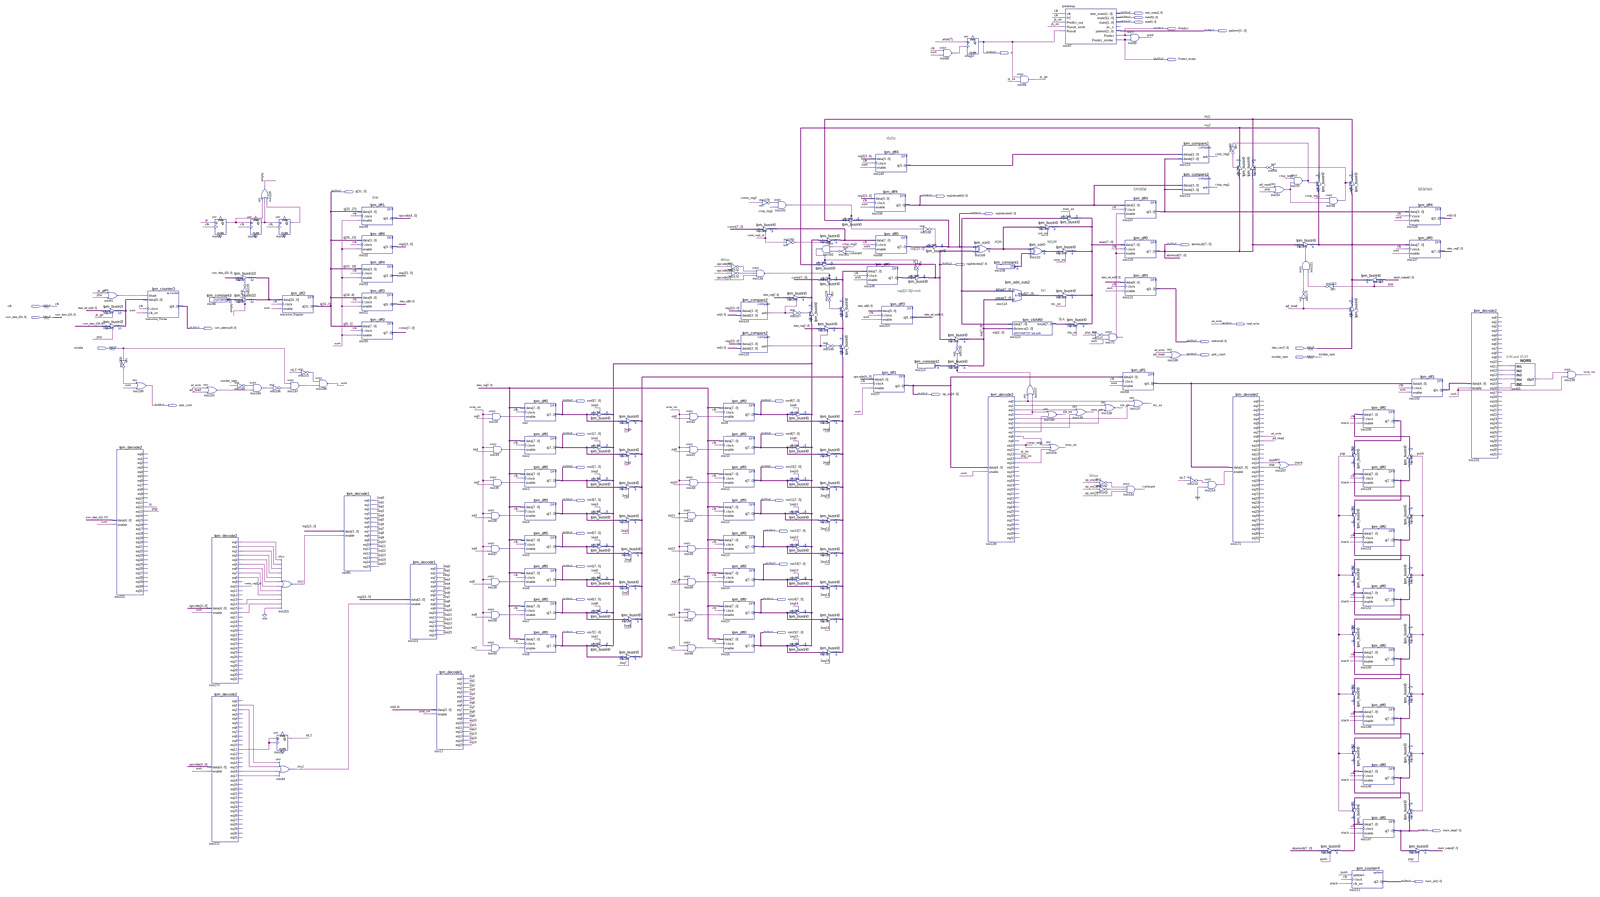
[diagram p0: schematic sheet, whole]
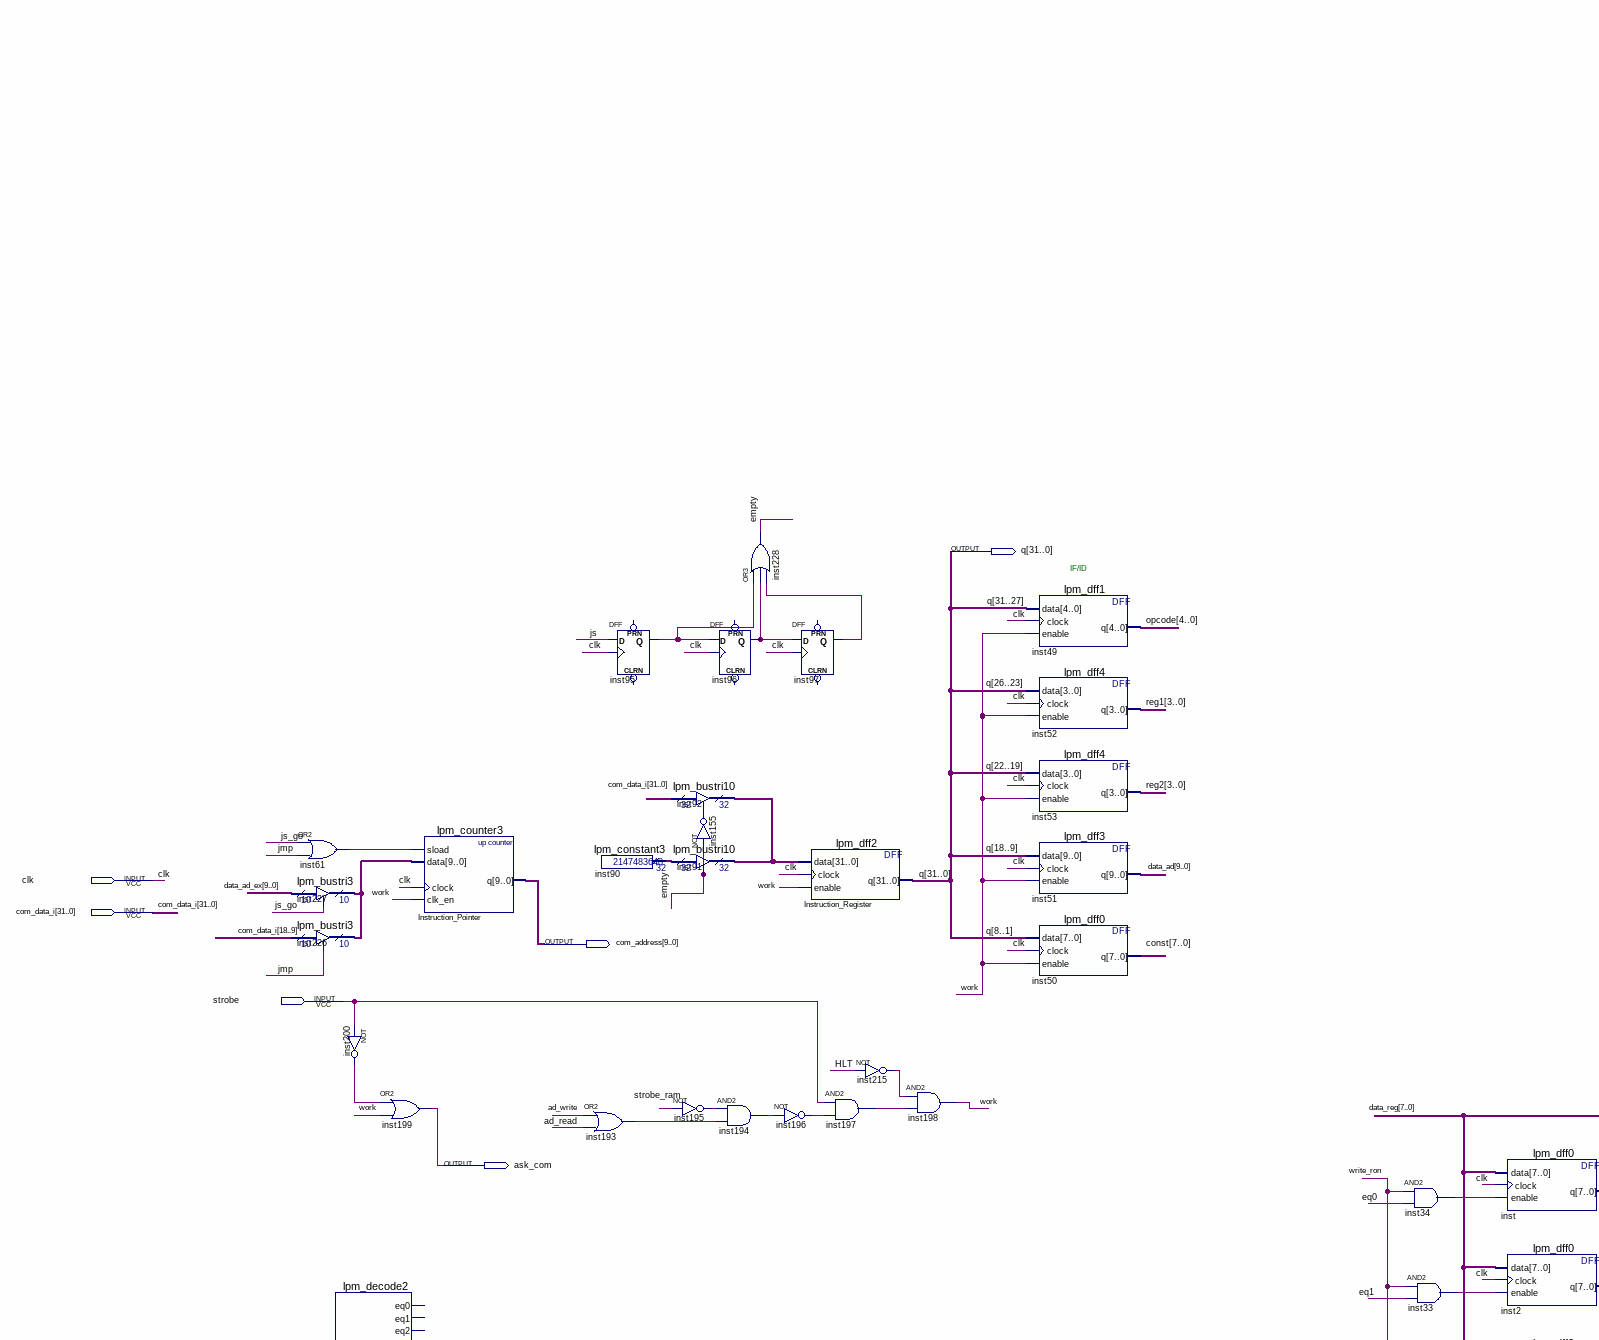
[diagram p1: schematic sheet, upper left part]
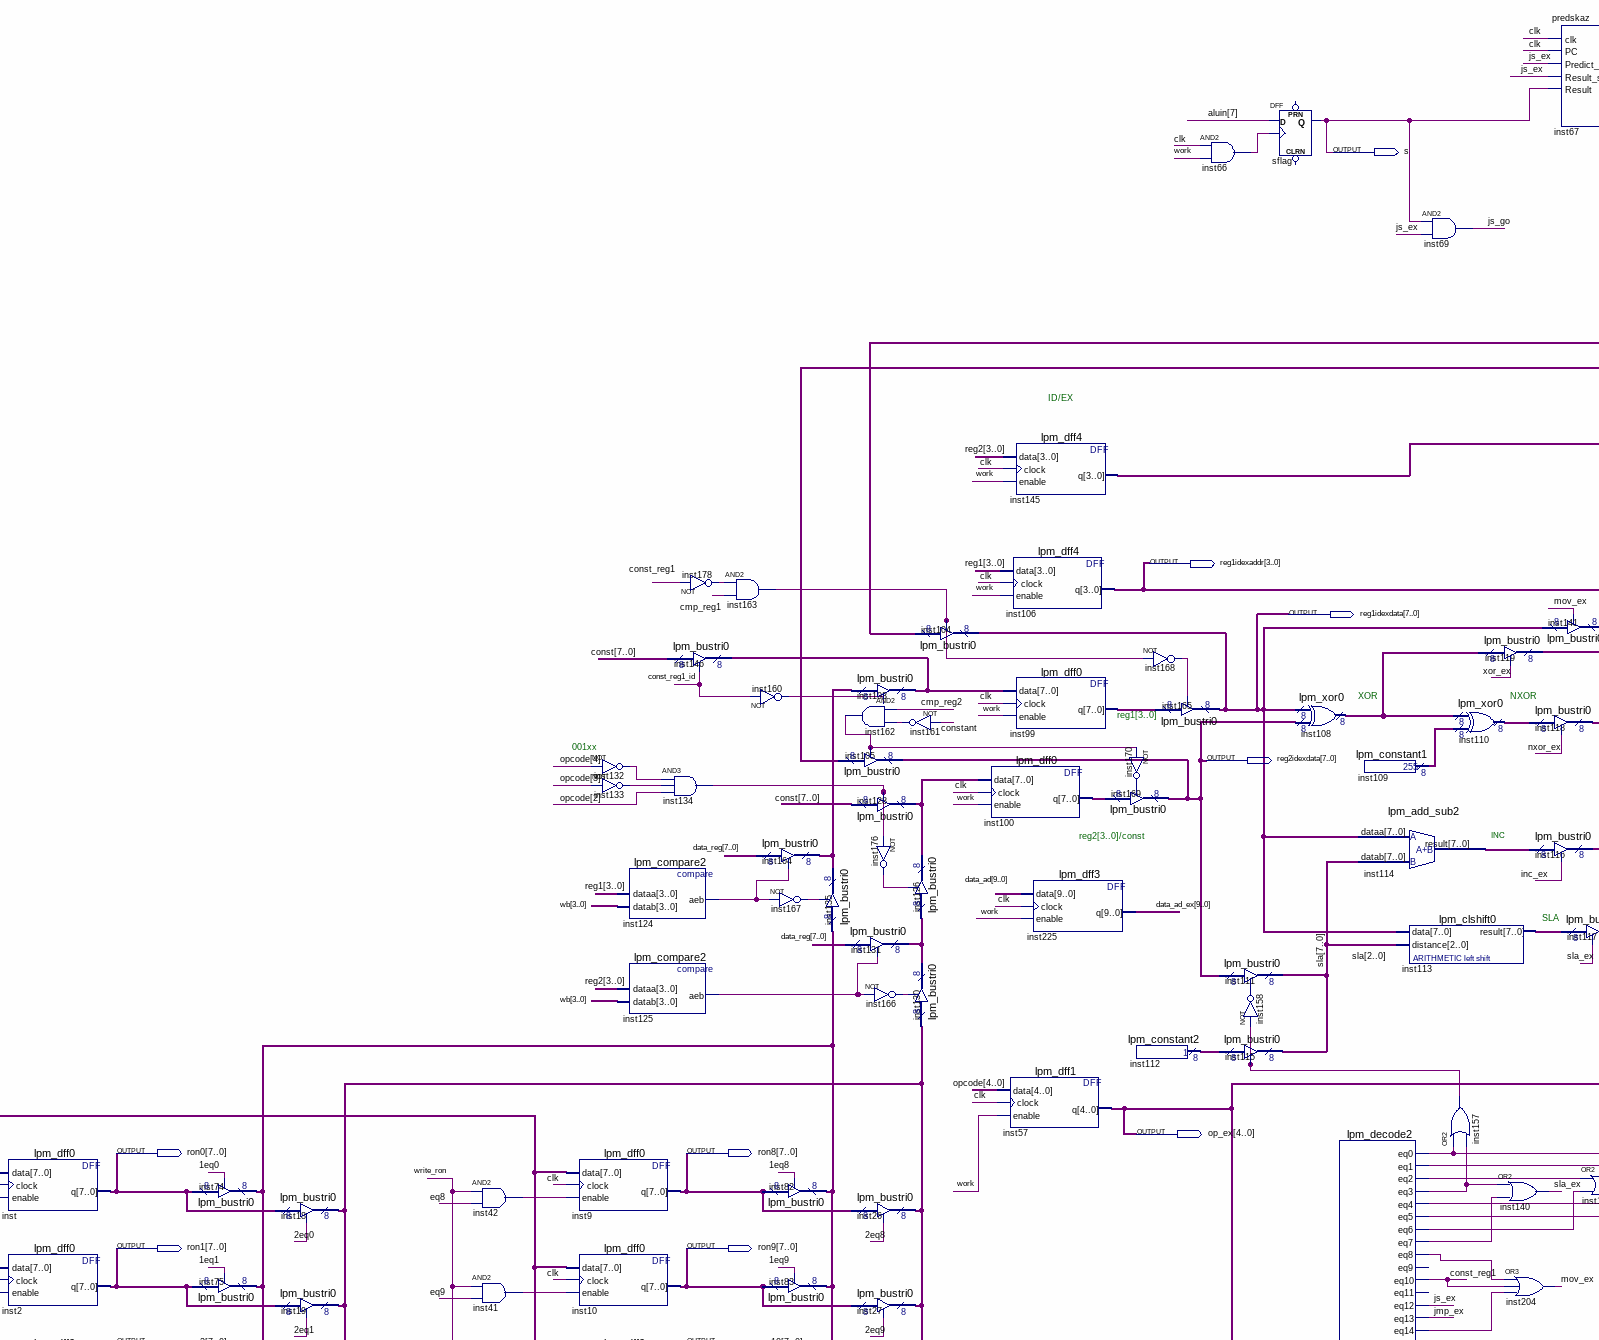
[diagram p2: schematic sheet, upper centre part]
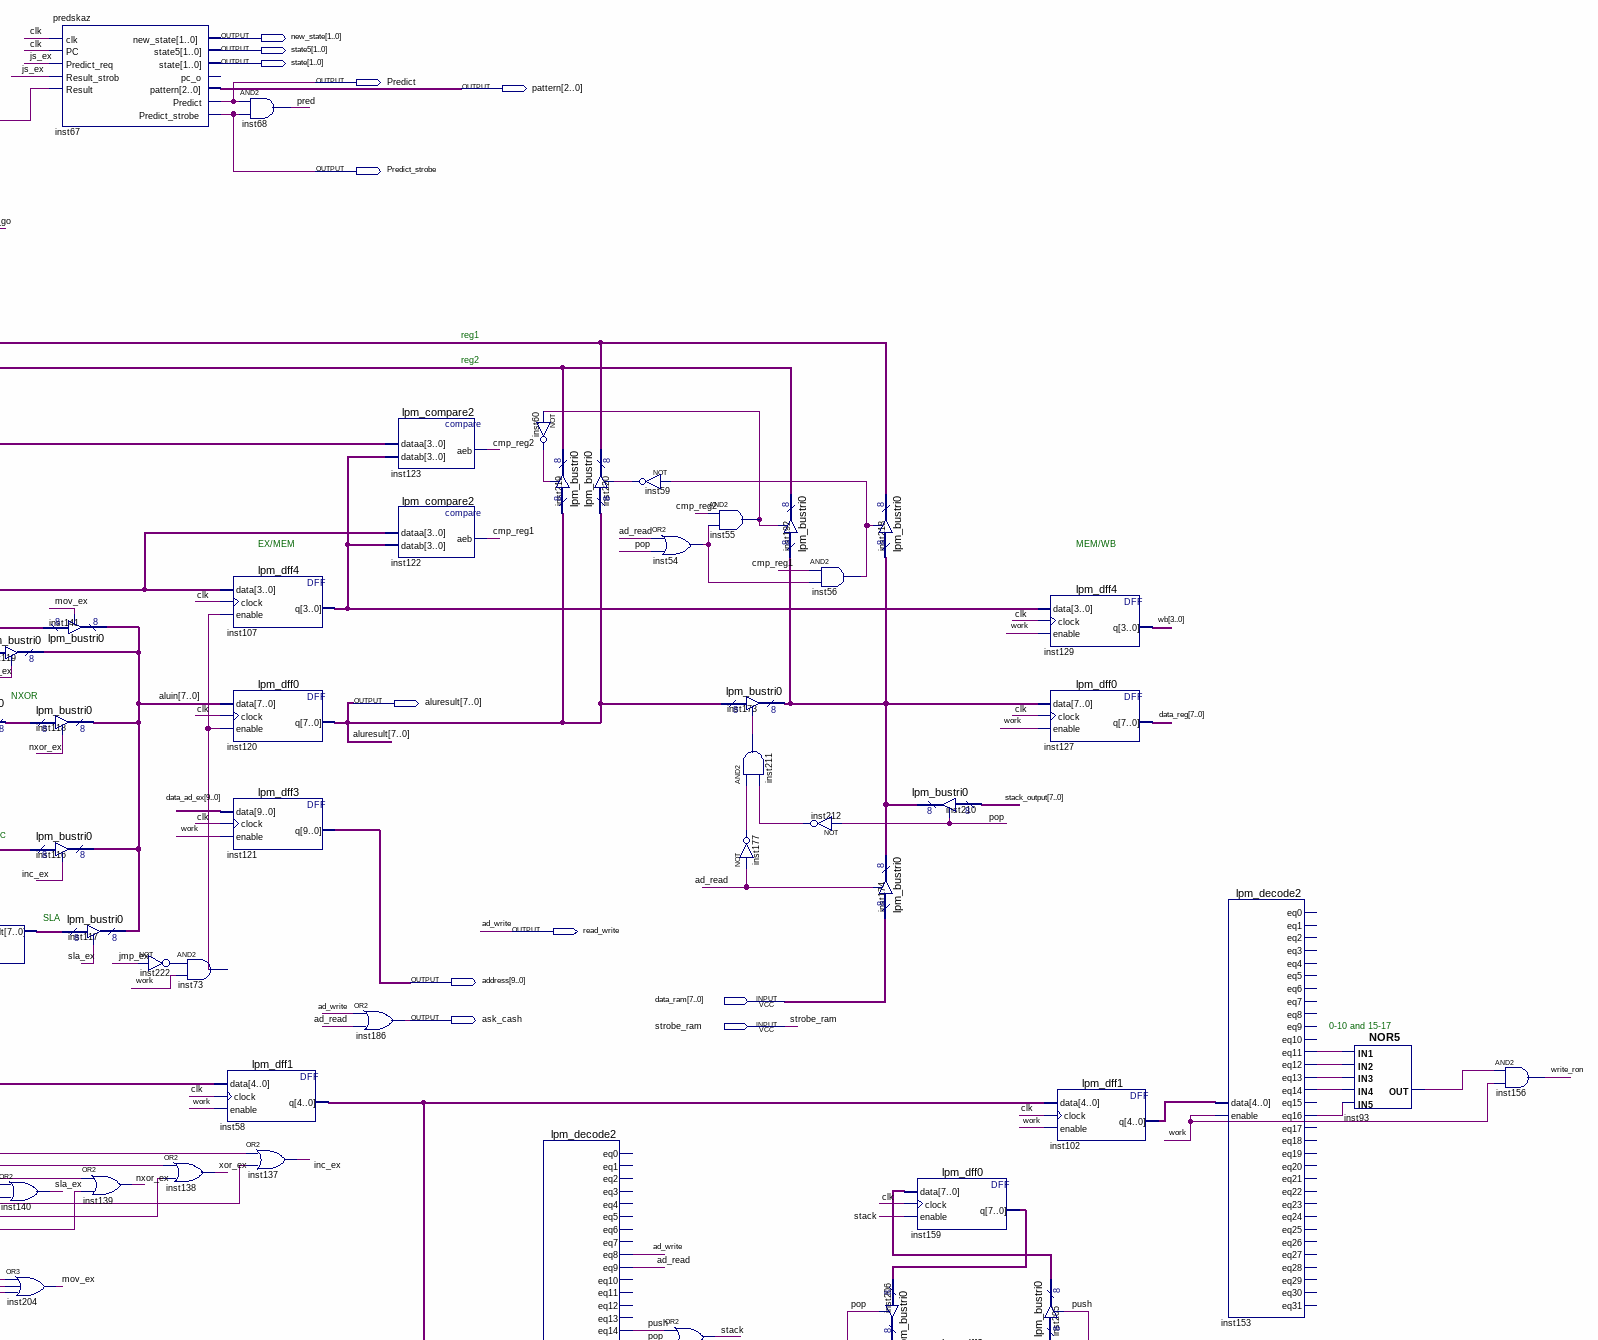
[diagram p3: schematic sheet, upper right part]
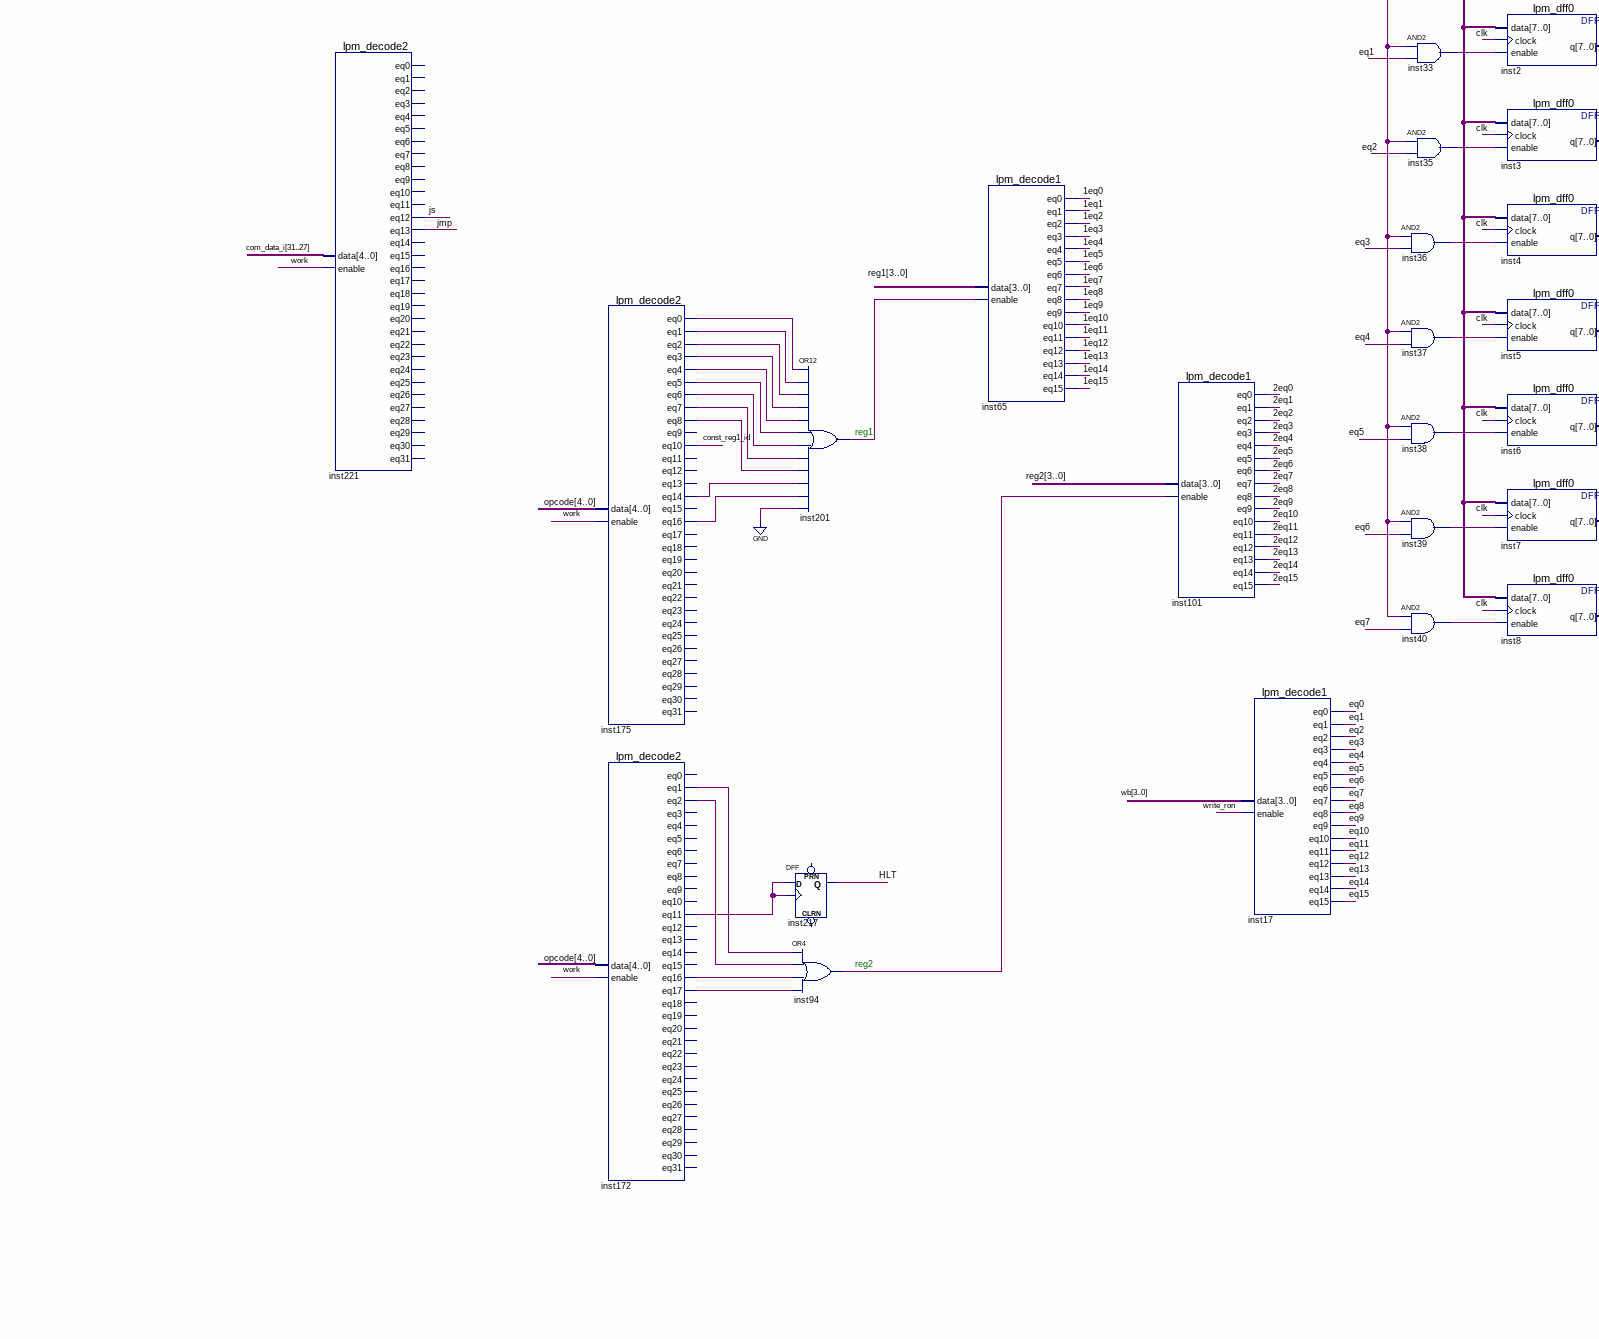
[diagram p4: schematic sheet, lower left part]
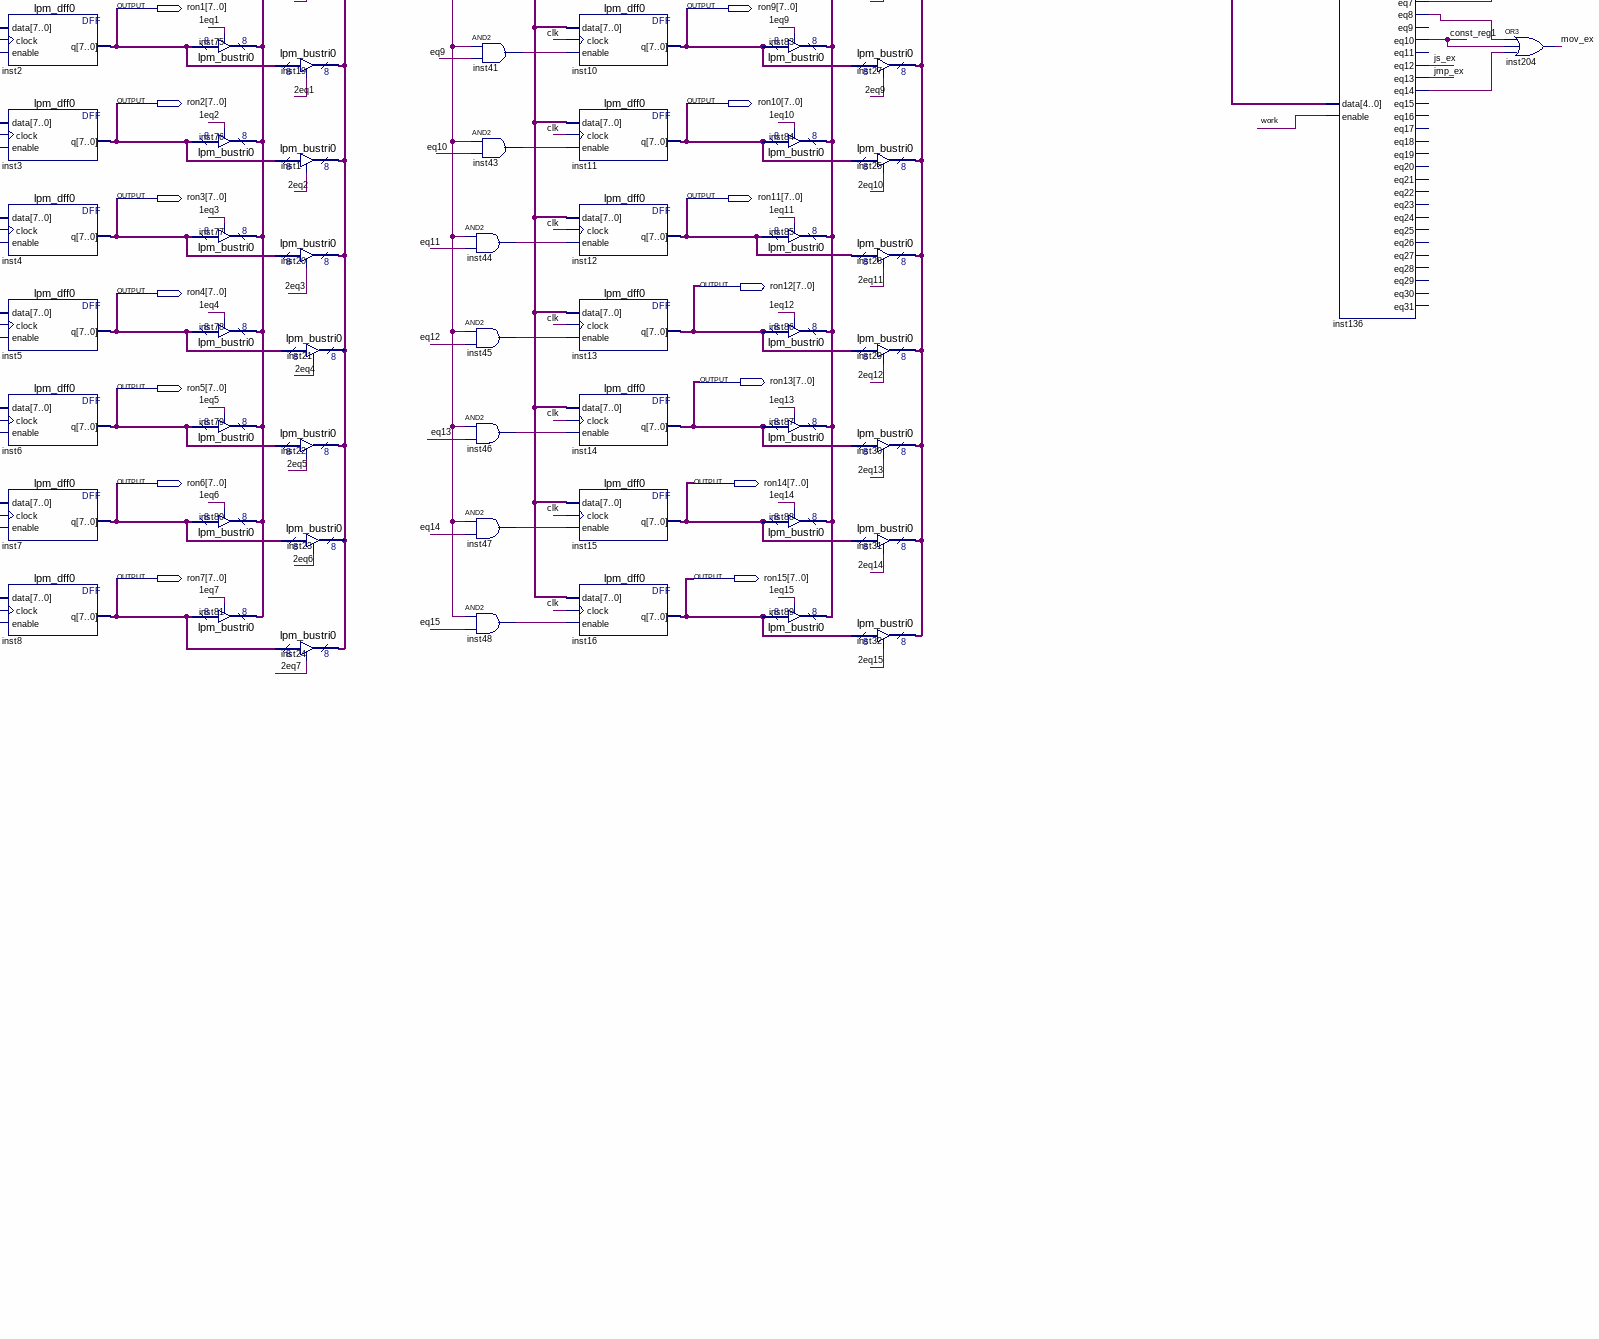
[diagram p5: schematic sheet, lower centre part]
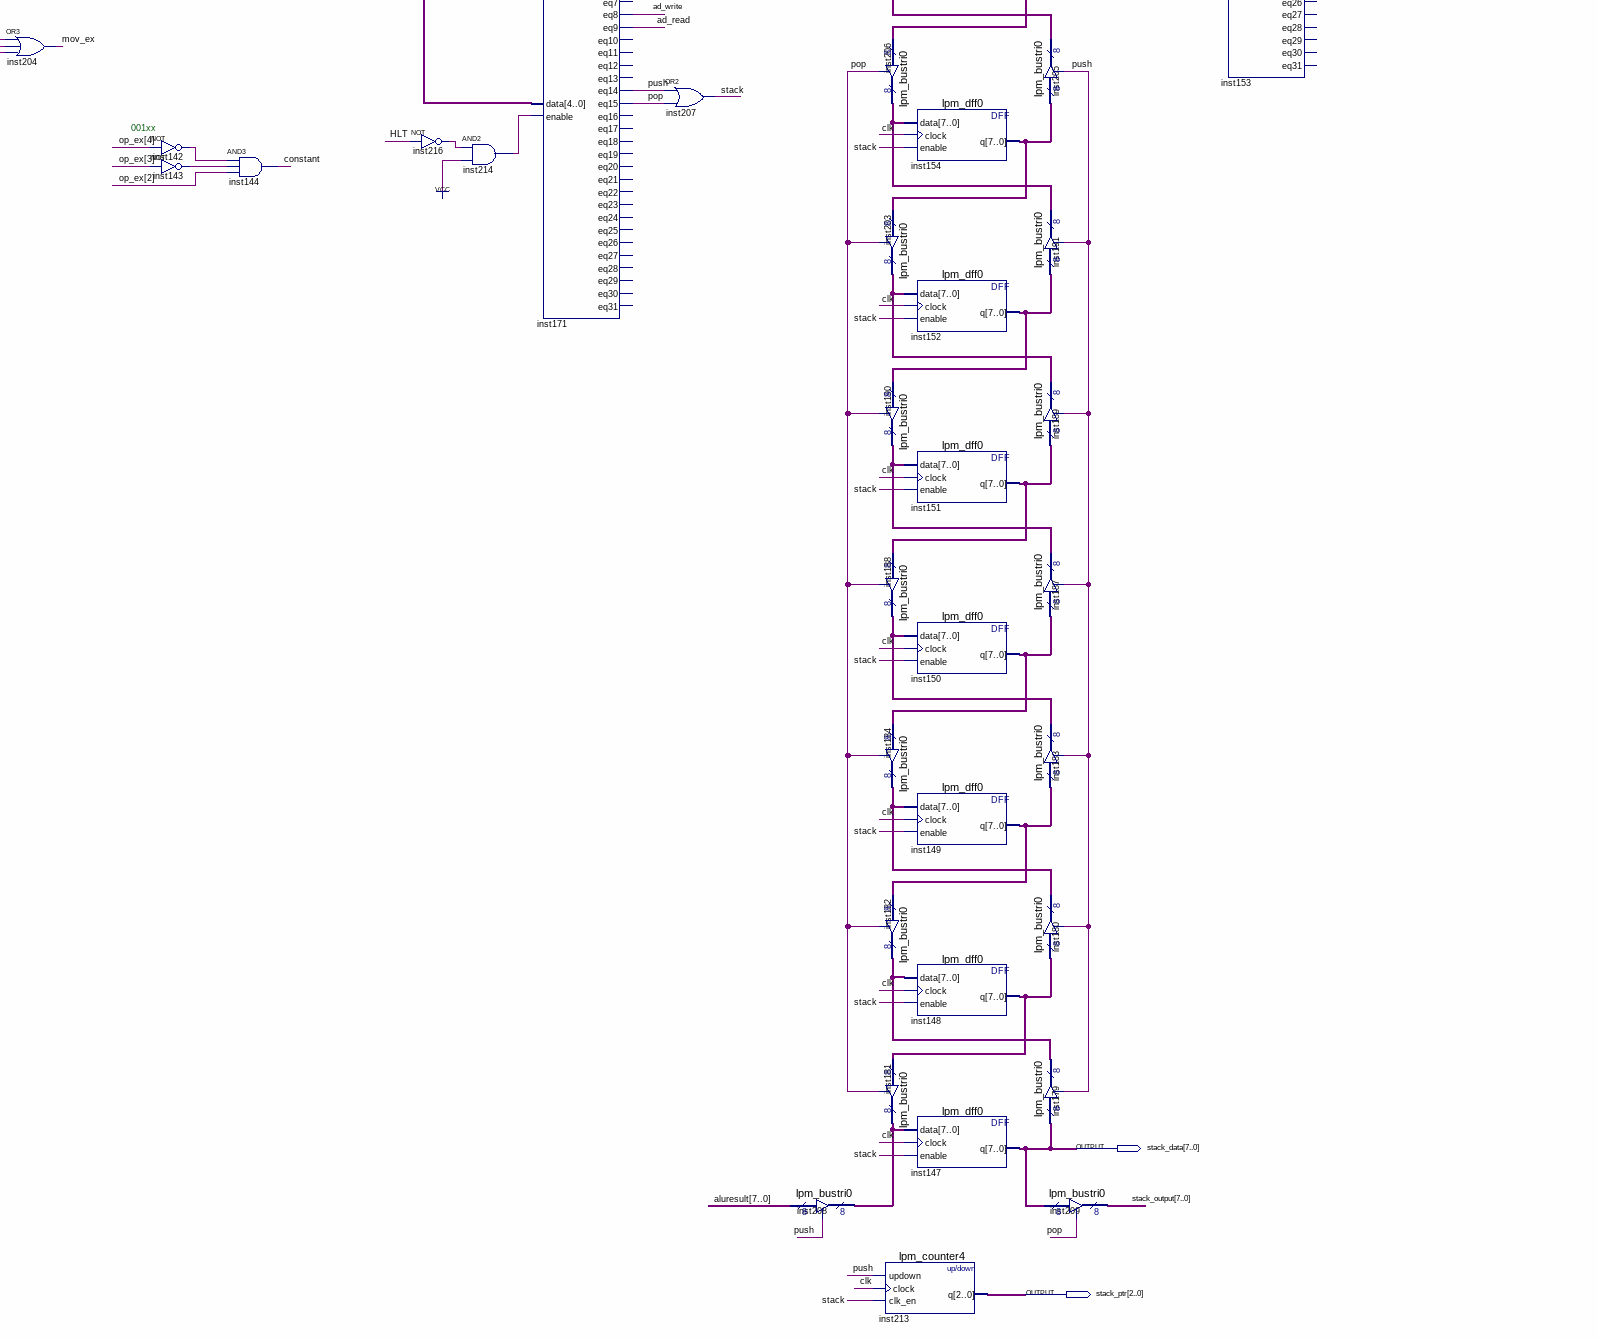
[diagram p6: schematic sheet, lower right part]
// Quartus schematic konveer.bdf as structural Verilog: 221 symbols, 41 pins
module konveer (
  input  clk,
  input  [31:0] com_data_i,
  input  strobe,
  input  [7:0] data_ram,
  input  strobe_ram,
  output [1:0] new_state,
  output [1:0] state5,
  output [1:0] state,
  output Predict,
  output [2:0] pattern,
  output s,
  output Predict_strobe,
  output [31:0] q,
  output [3:0] reg1idexaddr,
  output [7:0] reg1idexdata,
  output [7:0] aluresult,
  output [7:0] reg2idexdata,
  output read_write,
  output [9:0] com_address,
  output [9:0] address,
  output ask_cash,
  output [4:0] op_ex,
  output [7:0] ron0,
  output [7:0] ron8,
  output ask_com,
  output [7:0] ron1,
  output [7:0] ron9,
  output [7:0] ron2,
  output [7:0] ron10,
  output [7:0] ron3,
  output [7:0] ron11,
  output [7:0] ron12,
  output [7:0] ron4,
  output [7:0] ron13,
  output [7:0] ron5,
  output [7:0] ron6,
  output [7:0] ron14,
  output [7:0] ron7,
  output [7:0] ron15,
  output [7:0] stack_data,
  output [2:0] stack_ptr
);

  wire \1eq0 , \1eq1 , \1eq2 , \1eq3 , \1eq4 , \1eq5 , \1eq6 , \1eq7 , \1eq8 , \1eq9 , \1eq10 , \1eq11 ,
       \1eq12 , \1eq13 , \1eq14 , \1eq15 , \2eq0 , \2eq1 , \2eq2 , \2eq3 , \2eq4 , \2eq5 , \2eq6 , \2eq7 ,
       \2eq8 , \2eq9 , \2eq10 , \2eq11 , \2eq12 , \2eq13 , \2eq14 , \2eq15 , ad_read, cmp_reg1, cmp_reg2,
       const_reg1, const_reg1_id, constant, empty, eq0, eq1, eq2, eq3, eq4, eq5, eq6, eq7, eq8, eq9, eq10,
       eq11, eq12, eq13, eq14, eq15, HLT, inc_ex, inst33_out, inst34_out, inst35_out, inst36_out, inst37_out,
       inst38_out, inst39_out, inst40_out, inst41_out, inst42_out, inst43_out, inst44_out, inst45_out,
       inst46_out, inst47_out, inst48_out, inst54_out, inst55_out, inst56_out, inst59_out, inst60_out,
       inst61_out, inst66_out, inst73_out, inst93_out, inst94_out, inst95_q, inst96_q, inst97_q, inst124_aeb,
       inst125_aeb, inst132_out, inst133_out, inst134_out, inst136_eq0, inst136_eq1, inst136_eq2,
       inst136_eq3, inst136_eq4, inst136_eq5, inst136_eq6, inst136_eq7, inst136_eq8, inst136_eq14,
       inst142_out, inst143_out, inst153_eq11, inst153_eq12, inst153_eq13, inst153_eq14, inst153_eq16,
       inst155_out, inst157_out, inst158_out, inst160_out, inst161_out, inst162_out, inst163_out,
       inst166_out, inst167_out, inst168_out, inst170_out, inst172_eq1, inst172_eq2, inst172_eq11,
       inst172_eq16, inst172_eq17, inst175_eq0, inst175_eq1, inst175_eq2, inst175_eq3, inst175_eq4,
       inst175_eq5, inst175_eq6, inst175_eq7, inst175_eq8, inst175_eq14, inst175_eq16, inst176_out,
       inst177_out, inst178_out, inst193_out, inst194_out, inst195_out, inst196_out, inst197_out,
       inst200_out, inst201_out, inst211_out, inst212_out, inst214_out, inst215_out, inst216_out,
       inst222_out, jmp, jmp_ex, js, js_ex, js_go, mov_ex, nxor_ex, pop, pred, push, sla_ex, stack, work,
       write_ron, xor_ex;
  wire [3:0] inst107_q, inst145_q, reg1, reg2, wb;
  wire [4:0] inst58_q, inst102_q, opcode;
  wire [7:0] aluin, \const , data_reg, inst18_tridata, inst74_tridata, inst99_q, inst100_q, inst108_result,
       inst109_result, inst110_result, inst112_result, inst113_result, inst114_result, inst128_tridata,
       inst131_tridata, inst146_tridata, inst148_q, inst149_q, inst150_q, inst151_q, inst152_q, inst154_q,
       inst159_q, inst164_tridata, inst173_tridata, inst182_tridata, inst184_tridata, inst188_tridata,
       inst190_tridata, inst203_tridata, inst205_tridata, inst206_tridata, inst208_tridata, inst219_tridata,
       inst220_tridata, sla, stack_output;
  wire [9:0] data_ad, data_ad_ex, inst227_tridata;
  wire [31:0] inst90_result, inst92_tridata;

  or inst61 (inst61_out, js_go, jmp);
  lpm_bustri3 inst227 (.enabledt(js_go), .data(data_ad_ex), .tridata(inst227_tridata));
  lpm_bustri3 inst226 (.enabledt(jmp), .data(com_data_i[18:9]), .tridata(inst227_tridata));
  lpm_decode2 inst221 (
    .data(com_data_i[31:27]), .enable(work), .eq12(js), .eq13(jmp));  // open: eq0, eq1, eq2, eq3, eq4, eq5, eq6, eq7, eq8, eq9, eq10, eq11, eq14, eq15, eq16, eq17, eq18, eq19, eq20, eq21, eq22, eq23, eq24, eq25, eq26, eq27, eq28, eq29, eq30, eq31
  not inst200 (inst200_out, strobe);
  lpm_counter3 Instruction_Pointer (
    .sload(inst61_out), .data(inst227_tridata), .clock(clk), .clk_en(work), .q(com_address));
  or inst199 (ask_com, inst200_out, work);
  DFF inst95 (.CLK(clk), .D(js), .Q(inst95_q));  // open: CLRN, PRN
  lpm_constant3 inst90 (.result(inst90_result));
  or inst193 (inst193_out, read_write, ad_read);
  lpm_decode2 inst175 (
    .data(opcode), .enable(work), .eq0(inst175_eq0), .eq1(inst175_eq1), .eq2(inst175_eq2), .eq3(inst175_eq3),
    .eq4(inst175_eq4), .eq5(inst175_eq5), .eq6(inst175_eq6), .eq7(inst175_eq7), .eq8(inst175_eq8),
    .eq10(const_reg1_id), .eq14(inst175_eq14), .eq16(inst175_eq16));  // open: eq9, eq11, eq12, eq13, eq15, eq17, eq18, eq19, eq20, eq21, eq22, eq23, eq24, eq25, eq26, eq27, eq28, eq29, eq30, eq31
  lpm_decode2 inst172 (
    .data(opcode), .enable(work), .eq1(inst172_eq1), .eq2(inst172_eq2), .eq11(inst172_eq11),
    .eq16(inst172_eq16), .eq17(inst172_eq17));  // open: eq0, eq3, eq4, eq5, eq6, eq7, eq8, eq9, eq10, eq12, eq13, eq14, eq15, eq18, eq19, eq20, eq21, eq22, eq23, eq24, eq25, eq26, eq27, eq28, eq29, eq30, eq31
  lpm_bustri10 inst92 (.enabledt(inst155_out), .data(com_data_i), .tridata(inst92_tridata));
  lpm_bustri10 inst91 (.enabledt(empty), .data(inst90_result), .tridata(inst92_tridata));
  not inst195 (inst195_out, strobe_ram);
  DFF inst96 (.CLK(clk), .D(inst95_q), .Q(inst96_q));  // open: CLRN, PRN
  not inst155 (inst155_out, empty);
  and inst194 (inst194_out, inst195_out, inst193_out);
  or inst228 (empty, inst95_q, inst96_q, inst97_q);
  not inst196 (inst196_out, inst194_out);
  DFF inst97 (.CLK(clk), .D(inst96_q), .Q(inst97_q));  // open: CLRN, PRN
  lpm_dff2 Instruction_Register (.data(inst92_tridata), .clock(clk), .enable(work), .q(q));
  and inst197 (inst197_out, strobe, inst196_out);
  or inst201 (inst201_out, inst175_eq0, inst175_eq1, inst175_eq2, inst175_eq3, inst175_eq4, inst175_eq5, inst175_eq6, inst175_eq7, inst175_eq8, inst175_eq14, inst175_eq16, 1'b0);
  DFF inst217 (.CLK(inst172_eq11), .D(inst172_eq11), .Q(HLT));  // open: CLRN, PRN
  or inst94 (inst94_out, inst172_eq1, inst172_eq2, inst172_eq16, inst172_eq17);
  not inst215 (inst215_out, HLT);
  and inst198 (work, inst215_out, inst197_out);
  lpm_decode1 inst65 (
    .data(reg1), .enable(inst201_out), .eq0(\1eq0 ), .eq1(\1eq1 ), .eq2(\1eq2 ), .eq3(\1eq3 ), .eq4(\1eq4 ),
    .eq5(\1eq5 ), .eq6(\1eq6 ), .eq7(\1eq7 ), .eq8(\1eq8 ), .eq9(\1eq9 ), .eq10(\1eq10 ), .eq11(\1eq11 ),
    .eq12(\1eq12 ), .eq13(\1eq13 ), .eq14(\1eq14 ), .eq15(\1eq15 ));
  lpm_dff1 inst49 (.data(q[31:27]), .clock(clk), .enable(work), .q(opcode));
  lpm_dff4 inst52 (.data(q[26:23]), .clock(clk), .enable(work), .q(reg1));
  lpm_dff4 inst53 (.data(q[22:19]), .clock(clk), .enable(work), .q(reg2));
  lpm_dff3 inst51 (.data(q[18:9]), .clock(clk), .enable(work), .q(data_ad));
  lpm_dff0 inst50 (.data(q[8:1]), .clock(clk), .enable(work), .q(\const ));
  lpm_decode1 inst101 (
    .data(reg2), .enable(inst94_out), .eq0(\2eq0 ), .eq1(\2eq1 ), .eq2(\2eq2 ), .eq3(\2eq3 ), .eq4(\2eq4 ),
    .eq5(\2eq5 ), .eq6(\2eq6 ), .eq7(\2eq7 ), .eq8(\2eq8 ), .eq9(\2eq9 ), .eq10(\2eq10 ), .eq11(\2eq11 ),
    .eq12(\2eq12 ), .eq13(\2eq13 ), .eq14(\2eq14 ), .eq15(\2eq15 ));
  lpm_decode1 inst17 (
    .data(wb), .enable(write_ron), .eq0(eq0), .eq1(eq1), .eq2(eq2), .eq3(eq3), .eq4(eq4), .eq5(eq5),
    .eq6(eq6), .eq7(eq7), .eq8(eq8), .eq9(eq9), .eq10(eq10), .eq11(eq11), .eq12(eq12), .eq13(eq13),
    .eq14(eq14), .eq15(eq15));
  and inst34 (inst34_out, write_ron, eq0);
  and inst33 (inst33_out, write_ron, eq1);
  and inst35 (inst35_out, write_ron, eq2);
  and inst36 (inst36_out, write_ron, eq3);
  and inst37 (inst37_out, write_ron, eq4);
  and inst38 (inst38_out, write_ron, eq5);
  and inst39 (inst39_out, write_ron, eq6);
  and inst40 (inst40_out, write_ron, eq7);
  lpm_dff0 inst (.data(data_reg), .clock(clk), .enable(inst34_out), .q(ron0));
  lpm_dff0 inst2 (.data(data_reg), .clock(clk), .enable(inst33_out), .q(ron1));
  lpm_dff0 inst3 (.data(data_reg), .clock(clk), .enable(inst35_out), .q(ron2));
  lpm_dff0 inst4 (.data(data_reg), .clock(clk), .enable(inst36_out), .q(ron3));
  lpm_dff0 inst5 (.data(data_reg), .clock(clk), .enable(inst37_out), .q(ron4));
  lpm_dff0 inst6 (.data(data_reg), .clock(clk), .enable(inst38_out), .q(ron5));
  lpm_dff0 inst7 (.data(data_reg), .clock(clk), .enable(inst39_out), .q(ron6));
  lpm_dff0 inst8 (.data(data_reg), .clock(clk), .enable(inst40_out), .q(ron7));
  lpm_bustri0 inst74 (.enabledt(\1eq0 ), .data(ron0), .tridata(inst74_tridata));
  lpm_bustri0 inst75 (.enabledt(\1eq1 ), .data(ron1), .tridata(inst74_tridata));
  lpm_bustri0 inst76 (.enabledt(\1eq2 ), .data(ron2), .tridata(inst74_tridata));
  lpm_bustri0 inst77 (.enabledt(\1eq3 ), .data(ron3), .tridata(inst74_tridata));
  lpm_bustri0 inst78 (.enabledt(\1eq4 ), .data(ron4), .tridata(inst74_tridata));
  lpm_bustri0 inst79 (.enabledt(\1eq5 ), .data(ron5), .tridata(inst74_tridata));
  lpm_bustri0 inst80 (.enabledt(\1eq6 ), .data(ron6), .tridata(inst74_tridata));
  lpm_bustri0 inst81 (.enabledt(\1eq7 ), .data(ron7), .tridata(inst74_tridata));
  lpm_bustri0 inst18 (.enabledt(\2eq0 ), .data(ron0), .tridata(inst18_tridata));
  lpm_bustri0 inst19 (.enabledt(\2eq1 ), .data(ron1), .tridata(inst18_tridata));
  lpm_bustri0 inst1 (.enabledt(\2eq2 ), .data(ron2), .tridata(inst18_tridata));
  lpm_bustri0 inst20 (.enabledt(\2eq3 ), .data(ron3), .tridata(inst18_tridata));
  lpm_bustri0 inst21 (.enabledt(\2eq4 ), .data(ron4), .tridata(inst18_tridata));
  lpm_bustri0 inst22 (.enabledt(\2eq5 ), .data(ron5), .tridata(inst18_tridata));
  lpm_bustri0 inst23 (.enabledt(\2eq6 ), .data(ron6), .tridata(inst18_tridata));
  lpm_bustri0 inst24 (.enabledt(\2eq7 ), .data(ron7), .tridata(inst18_tridata));
  and inst42 (inst42_out, write_ron, eq8);
  and inst41 (inst41_out, write_ron, eq9);
  and inst43 (inst43_out, write_ron, eq10);
  and inst44 (inst44_out, write_ron, eq11);
  and inst45 (inst45_out, write_ron, eq12);
  and inst46 (inst46_out, write_ron, eq13);
  and inst47 (inst47_out, write_ron, eq14);
  and inst48 (inst48_out, write_ron, eq15);
  not inst132 (inst132_out, opcode[4]);
  not inst133 (inst133_out, opcode[3]);
  lpm_dff0 inst9 (.data(data_reg), .clock(clk), .enable(inst42_out), .q(ron8));
  lpm_dff0 inst10 (.data(data_reg), .clock(clk), .enable(inst41_out), .q(ron9));
  lpm_dff0 inst11 (.data(data_reg), .clock(clk), .enable(inst43_out), .q(ron10));
  lpm_dff0 inst12 (.data(data_reg), .clock(clk), .enable(inst44_out), .q(ron11));
  lpm_dff0 inst13 (.data(data_reg), .clock(clk), .enable(inst45_out), .q(ron12));
  lpm_dff0 inst14 (.data(data_reg), .clock(clk), .enable(inst46_out), .q(ron13));
  lpm_dff0 inst15 (.data(data_reg), .clock(clk), .enable(inst47_out), .q(ron14));
  lpm_dff0 inst16 (.data(data_reg), .clock(clk), .enable(inst48_out), .q(ron15));
  lpm_compare2 inst124 (.dataa(reg1), .datab(wb), .aeb(inst124_aeb));
  lpm_compare2 inst125 (.dataa(reg2), .datab(wb), .aeb(inst125_aeb));
  not inst178 (inst178_out, const_reg1);
  lpm_bustri0 inst146 (.enabledt(const_reg1_id), .data(\const ), .tridata(inst146_tridata));
  and inst134 (inst134_out, inst132_out, inst133_out, opcode[2]);
  and inst163 (inst163_out, inst178_out, cmp_reg1);
  not inst160 (inst160_out, const_reg1_id);
  lpm_bustri0 inst164 (.enabledt(inst124_aeb), .data(data_reg), .tridata(inst164_tridata));
  not inst167 (inst167_out, inst124_aeb);
  lpm_bustri0 inst82 (.enabledt(\1eq8 ), .data(ron8), .tridata(inst74_tridata));
  lpm_bustri0 inst83 (.enabledt(\1eq9 ), .data(ron9), .tridata(inst74_tridata));
  lpm_bustri0 inst84 (.enabledt(\1eq10 ), .data(ron10), .tridata(inst74_tridata));
  lpm_bustri0 inst85 (.enabledt(\1eq11 ), .data(ron11), .tridata(inst74_tridata));
  lpm_bustri0 inst86 (.enabledt(\1eq12 ), .data(ron12), .tridata(inst74_tridata));
  lpm_bustri0 inst87 (.enabledt(\1eq13 ), .data(ron13), .tridata(inst74_tridata));
  lpm_bustri0 inst88 (.enabledt(\1eq14 ), .data(ron14), .tridata(inst74_tridata));
  lpm_bustri0 inst89 (.enabledt(\1eq15 ), .data(ron15), .tridata(inst74_tridata));
  lpm_bustri0 inst103 (.enabledt(inst160_out), .data(inst164_tridata), .tridata(inst146_tridata));
  and inst162 (inst162_out, cmp_reg2, inst161_out);
  lpm_bustri0 inst105 (.enabledt(inst162_out), .data(inst219_tridata), .tridata(reg2idexdata));
  lpm_bustri0 inst128 (.enabledt(inst134_out), .data(\const ), .tridata(inst128_tridata));
  lpm_bustri0 inst135 (.enabledt(inst167_out), .data(inst74_tridata), .tridata(inst164_tridata));
  lpm_bustri0 inst131 (.enabledt(inst125_aeb), .data(data_reg), .tridata(inst131_tridata));
  lpm_bustri0 inst26 (.enabledt(\2eq8 ), .data(ron8), .tridata(inst18_tridata));
  lpm_bustri0 inst27 (.enabledt(\2eq9 ), .data(ron9), .tridata(inst18_tridata));
  lpm_bustri0 inst25 (.enabledt(\2eq10 ), .data(ron10), .tridata(inst18_tridata));
  lpm_bustri0 inst28 (.enabledt(\2eq11 ), .data(ron11), .tridata(inst18_tridata));
  lpm_bustri0 inst29 (.enabledt(\2eq12 ), .data(ron12), .tridata(inst18_tridata));
  lpm_bustri0 inst30 (.enabledt(\2eq13 ), .data(ron13), .tridata(inst18_tridata));
  lpm_bustri0 inst31 (.enabledt(\2eq14 ), .data(ron14), .tridata(inst18_tridata));
  lpm_bustri0 inst32 (.enabledt(\2eq15 ), .data(ron15), .tridata(inst18_tridata));
  not inst161 (inst161_out, constant);
  not inst176 (inst176_out, inst134_out);
  not inst166 (inst166_out, inst125_aeb);
  lpm_bustri0 inst104 (.enabledt(inst163_out), .data(inst220_tridata), .tridata(reg1idexdata));
  lpm_bustri0 inst126 (.enabledt(inst176_out), .data(inst131_tridata), .tridata(inst128_tridata));
  lpm_bustri0 inst130 (.enabledt(inst166_out), .data(inst18_tridata), .tridata(inst131_tridata));
  lpm_dff4 inst145 (.data(reg2), .clock(clk), .enable(work), .q(inst145_q));
  lpm_dff4 inst106 (.data(reg1), .clock(clk), .enable(work), .q(reg1idexaddr));
  lpm_dff0 inst99 (.data(inst146_tridata), .clock(clk), .enable(work), .q(inst99_q));
  lpm_dff0 inst100 (.data(inst128_tridata), .clock(clk), .enable(work), .q(inst100_q));
  lpm_dff1 inst57 (.data(opcode), .clock(clk), .enable(work), .q(op_ex));
  lpm_dff3 inst225 (.data(data_ad), .clock(clk), .enable(work), .q(data_ad_ex));
  lpm_bustri0 inst169 (.enabledt(inst170_out), .data(inst100_q), .tridata(reg2idexdata));
  not inst168 (inst168_out, inst163_out);
  lpm_bustri0 inst165 (.enabledt(inst168_out), .data(inst99_q), .tridata(reg1idexdata));
  not inst170 (inst170_out, inst162_out);
  lpm_constant2 inst112 (.result(inst112_result));
  and inst66 (inst66_out, clk, work);
  lpm_bustri0 inst111 (.enabledt(inst158_out), .data(reg2idexdata), .tridata(sla));
  not inst158 (inst158_out, inst157_out);
  lpm_bustri0 inst115 (.enabledt(inst157_out), .data(inst112_result), .tridata(sla));
  DFF sflag (.CLK(inst66_out), .D(aluin[7]), .Q(s));  // open: CLRN, PRN
  lpm_xor0 inst108 (.data0x(reg1idexdata), .data1x(reg2idexdata), .result(inst108_result));
  lpm_constant1 inst109 (.result(inst109_result));
  lpm_add_sub2 inst114 (.dataa(reg1idexdata), .datab(sla), .result(inst114_result));
  lpm_decode2 inst136 (
    .data(op_ex), .enable(work), .eq0(inst136_eq0), .eq1(inst136_eq1), .eq2(inst136_eq2), .eq3(inst136_eq3),
    .eq4(inst136_eq4), .eq5(inst136_eq5), .eq6(inst136_eq6), .eq7(inst136_eq7), .eq8(inst136_eq8),
    .eq10(const_reg1), .eq12(js_ex), .eq13(jmp_ex), .eq14(inst136_eq14));  // open: eq9, eq11, eq15, eq16, eq17, eq18, eq19, eq20, eq21, eq22, eq23, eq24, eq25, eq26, eq27, eq28, eq29, eq30, eq31
  lpm_clshift0 inst113 (.data(reg1idexdata), .distance(sla[2:0]), .result(inst113_result));
  and inst69 (js_go, s, js_ex);
  lpm_xor0 inst110 (.data0x(inst108_result), .data1x(inst109_result), .result(inst110_result));
  or inst157 (inst157_out, inst136_eq0, inst136_eq3);
  lpm_bustri0 inst119 (.enabledt(xor_ex), .data(inst108_result), .tridata(aluin));
  or inst140 (sla_ex, inst136_eq3, inst136_eq7);
  or inst204 (mov_ex, inst136_eq8, const_reg1, inst136_eq14);
  predskaz inst67 (
    .clk(clk), .PC(clk), .Predict_req(js_ex), .Result_strob(js_ex), .Result(s), .new_state(new_state),
    .state5(state5), .state(state), .pattern(pattern), .Predict(Predict), .Predict_strobe(Predict_strobe));  // open: pc_o
  lpm_bustri0 inst141 (.enabledt(mov_ex), .data(reg1idexdata), .tridata(aluin));
  lpm_bustri0 inst118 (.enabledt(nxor_ex), .data(inst110_result), .tridata(aluin));
  lpm_bustri0 inst116 (.enabledt(inc_ex), .data(inst114_result), .tridata(aluin));
  lpm_bustri0 inst117 (.enabledt(sla_ex), .data(inst113_result), .tridata(aluin));
  or inst139 (nxor_ex, inst136_eq2, inst136_eq6);
  not inst222 (inst222_out, jmp_ex);
  or inst138 (xor_ex, inst136_eq1, inst136_eq5);
  not inst142 (inst142_out, op_ex[4]);
  not inst143 (inst143_out, op_ex[3]);
  and inst73 (inst73_out, inst222_out, work);
  lpm_dff1 inst58 (.data(op_ex), .clock(clk), .enable(work), .q(inst58_q));
  and inst68 (pred, Predict, Predict_strobe);
  lpm_dff4 inst107 (.data(reg1idexaddr), .clock(clk), .enable(inst73_out), .q(inst107_q));
  lpm_dff0 inst120 (.data(aluin), .clock(clk), .enable(inst73_out), .q(aluresult));
  lpm_dff3 inst121 (.data(data_ad_ex), .clock(clk), .enable(work), .q(address));
  or inst137 (inc_ex, inst136_eq0, inst136_eq4);
  and inst144 (constant, inst142_out, inst143_out, op_ex[2]);
  or inst186 (ask_cash, read_write, ad_read);
  lpm_compare2 inst123 (.dataa(inst145_q), .datab(inst107_q), .aeb(cmp_reg2));
  lpm_compare2 inst122 (.dataa(reg1idexaddr), .datab(inst107_q), .aeb(cmp_reg1));
  not inst216 (inst216_out, HLT);
  and inst214 (inst214_out, inst216_out, 1'b1);
  not inst60 (inst60_out, inst55_out);
  lpm_bustri0 inst219 (.enabledt(inst60_out), .data(aluresult), .tridata(inst219_tridata));
  lpm_decode2 inst171 (
    .data(inst58_q), .enable(inst214_out), .eq8(read_write), .eq9(ad_read), .eq14(push), .eq15(pop));  // open: eq0, eq1, eq2, eq3, eq4, eq5, eq6, eq7, eq10, eq11, eq12, eq13, eq16, eq17, eq18, eq19, eq20, eq21, eq22, eq23, eq24, eq25, eq26, eq27, eq28, eq29, eq30, eq31
  lpm_bustri0 inst220 (.enabledt(inst59_out), .data(aluresult), .tridata(inst220_tridata));
  not inst59 (inst59_out, inst56_out);
  or inst54 (inst54_out, ad_read, pop);
  or inst207 (stack, push, pop);
  and inst55 (inst55_out, cmp_reg2, inst54_out);
  lpm_bustri0 inst173 (.enabledt(inst211_out), .data(aluresult), .tridata(inst173_tridata));
  and inst211 (inst211_out, inst177_out, inst212_out);
  not inst177 (inst177_out, ad_read);
  lpm_bustri0 inst192 (.enabledt(inst55_out), .data(inst173_tridata), .tridata(inst219_tridata));
  and inst56 (inst56_out, cmp_reg1, inst54_out);
  not inst212 (inst212_out, pop);
  lpm_bustri0 inst208 (.enabledt(push), .data(aluresult), .tridata(inst208_tridata));
  lpm_bustri0 inst218 (.enabledt(inst56_out), .data(inst173_tridata), .tridata(inst220_tridata));
  lpm_bustri0 inst174 (.enabledt(ad_read), .data(data_ram), .tridata(inst173_tridata));
  lpm_counter4 inst213 (.updown(push), .clock(clk), .clk_en(stack), .q(stack_ptr));
  lpm_bustri0 inst210 (.enabledt(pop), .data(stack_output), .tridata(inst173_tridata));
  lpm_dff0 inst159 (.data(inst205_tridata), .clock(clk), .enable(stack), .q(inst159_q));
  lpm_bustri0 inst206 (.enabledt(pop), .data(inst159_q), .tridata(inst206_tridata));
  lpm_dff0 inst154 (.data(inst206_tridata), .clock(clk), .enable(stack), .q(inst154_q));
  lpm_bustri0 inst203 (.enabledt(pop), .data(inst154_q), .tridata(inst203_tridata));
  lpm_dff0 inst152 (.data(inst203_tridata), .clock(clk), .enable(stack), .q(inst152_q));
  lpm_bustri0 inst190 (.enabledt(pop), .data(inst152_q), .tridata(inst190_tridata));
  lpm_dff0 inst151 (.data(inst190_tridata), .clock(clk), .enable(stack), .q(inst151_q));
  lpm_bustri0 inst188 (.enabledt(pop), .data(inst151_q), .tridata(inst188_tridata));
  lpm_dff0 inst150 (.data(inst188_tridata), .clock(clk), .enable(stack), .q(inst150_q));
  lpm_bustri0 inst184 (.enabledt(pop), .data(inst150_q), .tridata(inst184_tridata));
  lpm_dff0 inst149 (.data(inst184_tridata), .clock(clk), .enable(stack), .q(inst149_q));
  lpm_bustri0 inst182 (.enabledt(pop), .data(inst149_q), .tridata(inst182_tridata));
  lpm_dff0 inst148 (.data(inst182_tridata), .clock(clk), .enable(stack), .q(inst148_q));
  lpm_bustri0 inst181 (.enabledt(pop), .data(inst148_q), .tridata(inst208_tridata));
  lpm_dff0 inst147 (.data(inst208_tridata), .clock(clk), .enable(stack), .q(stack_data));
  lpm_dff4 inst129 (.data(inst107_q), .clock(clk), .enable(work), .q(wb));
  lpm_dff0 inst127 (.data(inst173_tridata), .clock(clk), .enable(work), .q(data_reg));
  lpm_dff1 inst102 (.data(inst58_q), .clock(clk), .enable(work), .q(inst102_q));
  lpm_bustri0 inst205 (.enabledt(push), .data(inst154_q), .tridata(inst205_tridata));
  lpm_bustri0 inst191 (.enabledt(push), .data(inst152_q), .tridata(inst206_tridata));
  lpm_bustri0 inst189 (.enabledt(push), .data(inst151_q), .tridata(inst203_tridata));
  lpm_bustri0 inst187 (.enabledt(push), .data(inst150_q), .tridata(inst190_tridata));
  lpm_bustri0 inst183 (.enabledt(push), .data(inst149_q), .tridata(inst188_tridata));
  lpm_bustri0 inst180 (.enabledt(push), .data(inst148_q), .tridata(inst184_tridata));
  lpm_bustri0 inst179 (.enabledt(push), .data(stack_data), .tridata(inst182_tridata));
  lpm_bustri0 inst209 (.enabledt(pop), .data(stack_data), .tridata(stack_output));
  lpm_decode2 inst153 (
    .data(inst102_q), .enable(work), .eq11(inst153_eq11), .eq12(inst153_eq12), .eq13(inst153_eq13),
    .eq14(inst153_eq14), .eq16(inst153_eq16));  // open: eq0, eq1, eq2, eq3, eq4, eq5, eq6, eq7, eq8, eq9, eq10, eq15, eq17, eq18, eq19, eq20, eq21, eq22, eq23, eq24, eq25, eq26, eq27, eq28, eq29, eq30, eq31
  nor inst93 (inst93_out, inst153_eq11, inst153_eq12, inst153_eq13, inst153_eq14, inst153_eq16);
  and inst156 (write_ron, inst93_out, work);

  // Other names for the same wires on the sheet: ad_write = read_write

  // Notes on the sheet:
  //   reg1
  //   reg2
  //   ID/EX
  //   EX/MEM
  //   MEM/WB
  //   IF/ID
  //   XOR
  //   NXOR
  //   reg1[3..0]
  //   001xx
  //   reg2[3..0]/const
  //   INC
  //   SLA
  //   0-10 and 15-17
  //   001xx
  //   reg1
  //   reg2
endmodule
